# Altium schematic sheet dental-uint-doctors_table v1_0.SchDoc
size 840 x 594 mm
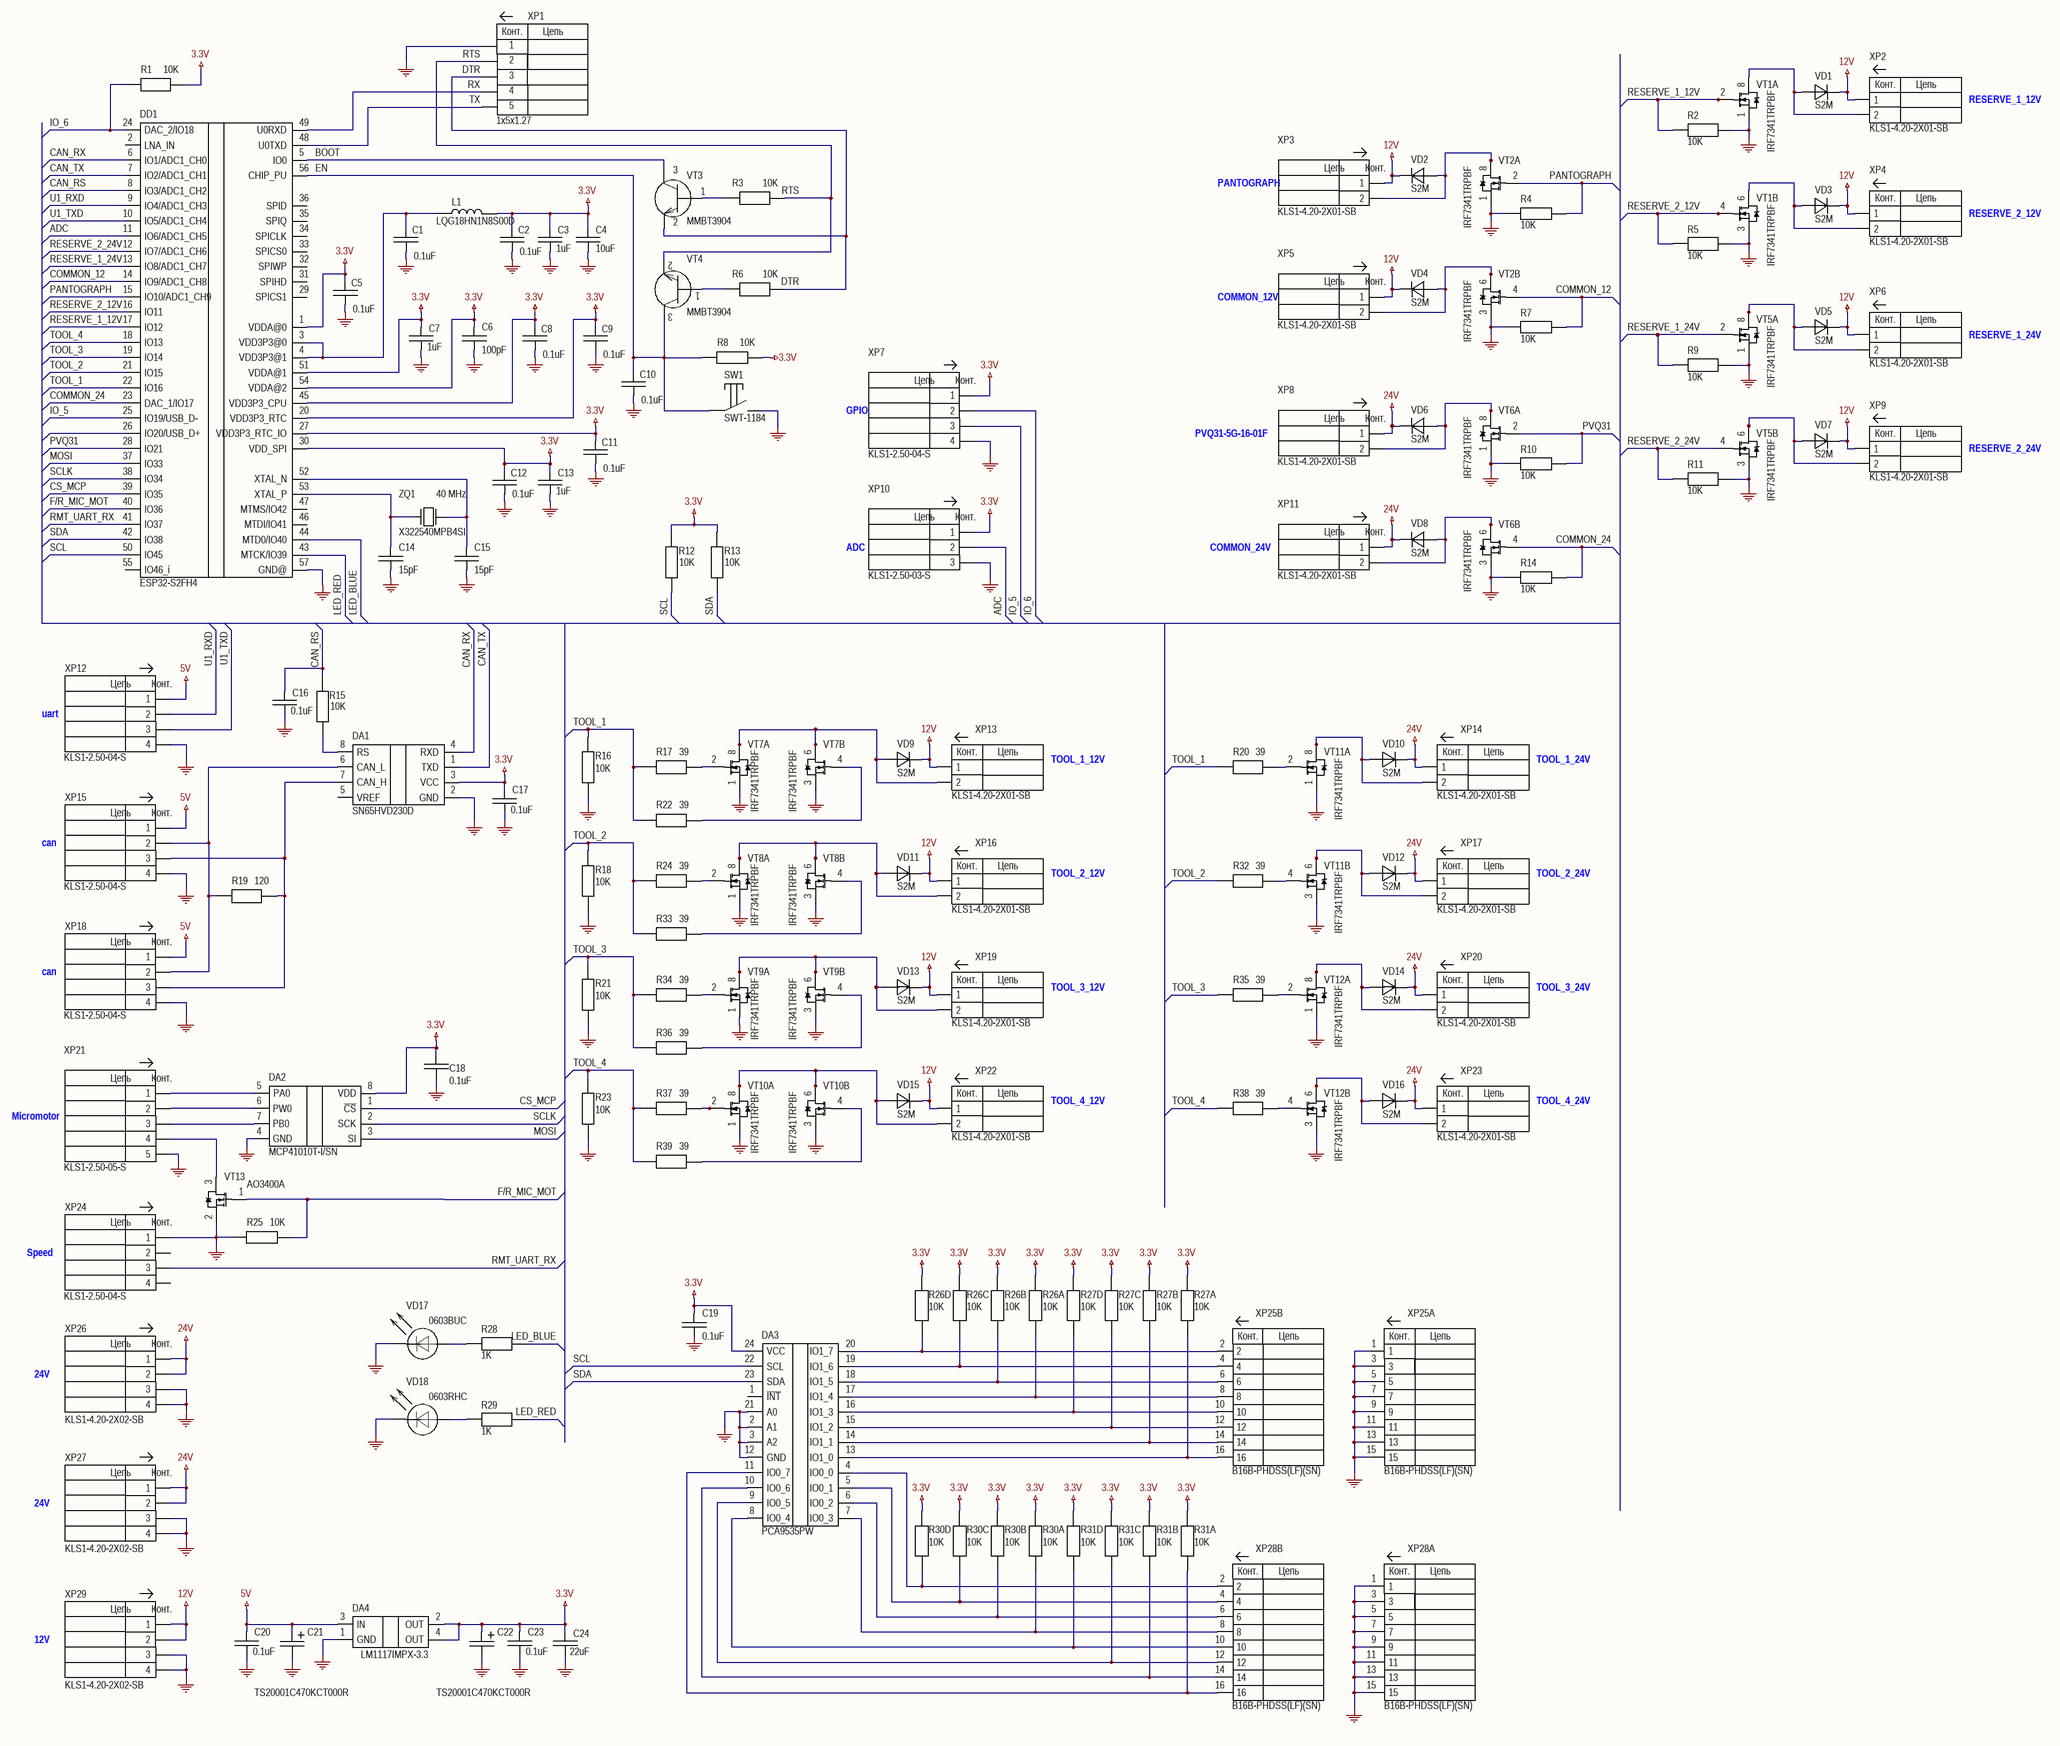
[diagram p0: dental-uint-doctors_table v1_0.SchDoc]

## Parts
C1  value 0.1uF  [CC_0603]  (hidden comment: CC0603KRX7R5BB104)
C2  value 0.1uF  [CC_0603]  (hidden comment: CC0603KRX7R5BB104)
C3  value 1uF  [CC_0603]  (hidden comment: CL10A105KB8NNNC)
C4  value 10uF  [CC_0603]  (hidden comment: CL10A106KP8NNNC)
C5  value 0.1uF  [CC_0603]  (hidden comment: CC0603KRX7R5BB104)
C6  value 100pF  [CC_0603]  (hidden comment: CC0603FRNPO9BN101)
C7  value 1uF  [CC_0603]  (hidden comment: CL10A105KB8NNNC)
C8  value 0.1uF  [CC_0603]  (hidden comment: CC0603KRX7R5BB104)
C9  value 0.1uF  [CC_0603]  (hidden comment: CC0603KRX7R5BB104)
C10  value 0.1uF  [CC_0603]  (hidden comment: CC0603KRX7R5BB104)
C11  value 0.1uF  [CC_0603]  (hidden comment: CC0603KRX7R5BB104)
C12  value 0.1uF  [CC_0603]  (hidden comment: CC0603KRX7R5BB104)
C13  value 1uF  [CC_0603]  (hidden comment: CL10A105KB8NNNC)
C14  value 15pF  [CC_0603]  (hidden comment: CC0603GPNPO9BN150)
C15  value 15pF  [CC_0603]  (hidden comment: CC0603GPNPO9BN150)
C16  value 0.1uF  [CC_0603]  (hidden comment: CC0603KRX7R5BB104)
C17  value 0.1uF  [CC_0603]  (hidden comment: CC0603KRX7R5BB104)
C18  value 0.1uF  [CC_0603]  (hidden comment: CC0603KRX7R5BB104)
C19  value 0.1uF  [CC_0603]  (hidden comment: CC0603KRX7R5BB104)
C20  value 0.1uF  [CC_0603]  (hidden comment: CC0603KRX7R5BB104)
C21  TS20001C470KCT000R  [CC_TANT_C]
C22  TS20001C470KCT000R  [CC_TANT_C]
C23  value 0.1uF  [CC_0603]  (hidden comment: CC0603KRX7R5BB104)
C24  value 22uF  [CC_0805]  (hidden comment: GRM21BR60J226ME39L)
DA1  SN65HVD230D  [SOIC-8]
DA2  MCP41010T-I/SN  [SOIC-8]
DA3  PCA9535PW  [TSSOP-24]
DA4  LM1117IMPX-3.3  [SOT-223]
DD1  ESP32-S2FH4  [QFN40P700X700X90-57T400N]
L1  LQG18HN1N8S00D  [IC_0603]
R1  value 10K  [RC_0603]  (hidden comment: AC0603FR-0710KL)
R2  value 10K  [RC_0603]  (hidden comment: AC0603FR-0710KL)
R3  value 10K  [RC_0603]  (hidden comment: AC0603FR-0710KL)
R4  value 10K  [RC_0603]  (hidden comment: AC0603FR-0710KL)
R5  value 10K  [RC_0603]  (hidden comment: AC0603FR-0710KL)
R6  value 10K  [RC_0603]  (hidden comment: AC0603FR-0710KL)
R7  value 10K  [RC_0603]  (hidden comment: AC0603FR-0710KL)
R8  value 10K  [RC_0603]  (hidden comment: AC0603FR-0710KL)
R9  value 10K  [RC_0603]  (hidden comment: AC0603FR-0710KL)
R10  value 10K  [RC_0603]  (hidden comment: AC0603FR-0710KL)
R11  value 10K  [RC_0603]  (hidden comment: AC0603FR-0710KL)
R12  value 10K  [RC_0603]  (hidden comment: AC0603FR-0710KL)
R13  value 10K  [RC_0603]  (hidden comment: AC0603FR-0710KL)
R14  value 10K  [RC_0603]  (hidden comment: AC0603FR-0710KL)
R15  value 10K  [RC_0603]  (hidden comment: AC0603FR-0710KL)
R16  value 10K  [RC_0603]  (hidden comment: AC0603FR-0710KL)
R17  value 39  [RC_0603]  (hidden comment: RC0603FR-0739RL)
R18  value 10K  [RC_0603]  (hidden comment: AC0603FR-0710KL)
R19  value 120  [RC_0603]  (hidden comment: RC0603FR-07120RL)
R20  value 39  [RC_0603]  (hidden comment: RC0603FR-0739RL)
R21  value 10K  [RC_0603]  (hidden comment: AC0603FR-0710KL)
R22  value 39  [RC_0603]  (hidden comment: RC0603FR-0739RL)
R23  value 10K  [RC_0603]  (hidden comment: AC0603FR-0710KL)
R24  value 39  [RC_0603]  (hidden comment: RC0603FR-0739RL)
R25  value 10K  [RC_0603]  (hidden comment: AC0603FR-0710KL)
R26  value 10K  [RC_0603x4]  (hidden comment: YC164-JR-0710KL)  (parts A,B,C,D of 4)
R27  value 10K  [RC_0603x4]  (hidden comment: YC164-JR-0710KL)  (parts A,B,C,D of 4)
R28  value 1K  [RC_0603]  (hidden comment: AC0603FR-071KL)
R29  value 1K  [RC_0603]  (hidden comment: AC0603FR-071KL)
R30  value 10K  [RC_0603x4]  (hidden comment: YC164-JR-0710KL)  (parts A,B,C,D of 4)
R31  value 10K  [RC_0603x4]  (hidden comment: YC164-JR-0710KL)  (parts A,B,C,D of 4)
R32  value 39  [RC_0603]  (hidden comment: RC0603FR-0739RL)
R33  value 39  [RC_0603]  (hidden comment: RC0603FR-0739RL)
R34  value 39  [RC_0603]  (hidden comment: RC0603FR-0739RL)
R35  value 39  [RC_0603]  (hidden comment: RC0603FR-0739RL)
R36  value 39  [RC_0603]  (hidden comment: RC0603FR-0739RL)
R37  value 39  [RC_0603]  (hidden comment: RC0603FR-0739RL)
R38  value 39  [RC_0603]  (hidden comment: RC0603FR-0739RL)
R39  value 39  [RC_0603]  (hidden comment: RC0603FR-0739RL)
SW1  SWT-1184  [IT-1184]
VD1  S2M  [DO-214AA(SMB)]
VD2  S2M  [DO-214AA(SMB)]
VD3  S2M  [DO-214AA(SMB)]
VD4  S2M  [DO-214AA(SMB)]
VD5  S2M  [DO-214AA(SMB)]
VD6  S2M  [DO-214AA(SMB)]
VD7  S2M  [DO-214AA(SMB)]
VD8  S2M  [DO-214AA(SMB)]
VD9  S2M  [DO-214AA(SMB)]
VD10  S2M  [DO-214AA(SMB)]
VD11  S2M  [DO-214AA(SMB)]
VD12  S2M  [DO-214AA(SMB)]
VD13  S2M  [DO-214AA(SMB)]
VD14  S2M  [DO-214AA(SMB)]
VD15  S2M  [DO-214AA(SMB)]
VD16  S2M  [DO-214AA(SMB)]
VD17  0603BUC  [LED_0603]
VD18  0603RHC  [LED_0603]
VT1  IRF7341TRPBF  [SOIC-8]  (parts A,B of 2)
VT2  IRF7341TRPBF  [SOIC-8]  (parts A,B of 2)
VT3  MMBT3904  [SOT-23-3]
VT4  MMBT3904  [SOT-23-3]
VT5  IRF7341TRPBF  [SOIC-8]  (parts A,B of 2)
VT6  IRF7341TRPBF  [SOIC-8]  (parts A,B of 2)
VT7  IRF7341TRPBF  [SOIC-8]  (parts A,B of 2)
VT8  IRF7341TRPBF  [SOIC-8]  (parts A,B of 2)
VT9  IRF7341TRPBF  [SOIC-8]  (parts A,B of 2)
VT10  IRF7341TRPBF  [SOIC-8]  (parts A,B of 2)
VT11  IRF7341TRPBF  [SOIC-8]  (parts A,B of 2)
VT12  IRF7341TRPBF  [SOIC-8]  (parts A,B of 2)
VT13  AO3400A  [SOT-23-3]
XP1  1x5x1.27  [XT_1x5x1.27_offset]
XP2  KLS1-4.20-2X01-SB  name: RESERVE_1_12V  [KLS1-4.20-2X01-SB]
XP3  KLS1-4.20-2X01-SB  name: PANTOGRAPH  [KLS1-4.20-2X01-SB]
XP4  KLS1-4.20-2X01-SB  name: RESERVE_2_12V  [KLS1-4.20-2X01-SB]
XP5  KLS1-4.20-2X01-SB  name: COMMON_12V  [KLS1-4.20-2X01-SB]
XP6  KLS1-4.20-2X01-SB  name: RESERVE_1_24V  [KLS1-4.20-2X01-SB]
XP7  KLS1-2.50-04-S  name: GPIO  [KLS1-2.50-04-S]
XP8  KLS1-4.20-2X01-SB  name: PVQ31-5G-16-01F  [KLS1-4.20-2X01-SB]
XP9  KLS1-4.20-2X01-SB  name: RESERVE_2_24V  [KLS1-4.20-2X01-SB]
XP10  KLS1-2.50-03-S  name: ADC  [KLS1-2.50-03-S]
XP11  KLS1-4.20-2X01-SB  name: COMMON_24V  [KLS1-4.20-2X01-SB]
XP12  KLS1-2.50-04-S  name: uart  [KLS1-2.50-04-S]
XP13  KLS1-4.20-2X01-SB  name: TOOL_1_12V  [KLS1-4.20-2X01-SB]
XP14  KLS1-4.20-2X01-SB  name: TOOL_1_24V  [KLS1-4.20-2X01-SB]
XP15  KLS1-2.50-04-S  name: can  [KLS1-2.50-04-S]
XP16  KLS1-4.20-2X01-SB  name: TOOL_2_12V  [KLS1-4.20-2X01-SB]
XP17  KLS1-4.20-2X01-SB  name: TOOL_2_24V  [KLS1-4.20-2X01-SB]
XP18  KLS1-2.50-04-S  name: can  [KLS1-2.50-04-S]
XP19  KLS1-4.20-2X01-SB  name: TOOL_3_12V  [KLS1-4.20-2X01-SB]
XP20  KLS1-4.20-2X01-SB  name: TOOL_3_24V  [KLS1-4.20-2X01-SB]
XP21  KLS1-2.50-05-S  name: Micromotor  [KLS1-2.50-05-S]
XP22  KLS1-4.20-2X01-SB  name: TOOL_4_12V  [KLS1-4.20-2X01-SB]
XP23  KLS1-4.20-2X01-SB  name: TOOL_4_24V  [KLS1-4.20-2X01-SB]
XP24  KLS1-2.50-04-S  name: Speed  [KLS1-2.50-04-S]
XP25  B16B-PHDSS(LF)(SN)  [B16B-PHDSS]  (parts A,B of 2)
XP26  KLS1-4.20-2X02-SB  name: 24V  [KLS1-4.20-2X02-SB]
XP27  KLS1-4.20-2X02-SB  name: 24V  [KLS1-4.20-2X02-SB]
XP28  B16B-PHDSS(LF)(SN)  [B16B-PHDSS]  (parts A,B of 2)
XP29  KLS1-4.20-2X02-SB  name: 12V  [KLS1-4.20-2X02-SB]
ZQ1  X322540MPB4SI  value 40 MHz  [OSC: 3225]

## Nets
3.3V: C2.2 C3.2 C4.2 C5.2 C6.2 C7.2 C8.2 C9.2 C11.2 C12.2 C13.2 C17.2 C18.2 C19.2 C22.1 C23.2 C24.2 DA1.3(VCC) DA2.8(VDD) DA3.24(VCC) DA4.2(OUT) DA4.4(OUT) DD1.1(VDDA@0) DD1.20(VDD3P3_RTC) DD1.27(VDD3P3_RTC_IO) DD1.30(VDD_SPI) DD1.45(VDD3P3_CPU) DD1.51(VDDA@1) DD1.54(VDDA@2) L1.2 R1.2 R8.2 R12.2 R13.2 R26.5 R26.6 R26.7 R26.8 R27.5 R27.6 R27.7 R27.8 R30.5 R30.6 R30.7 R30.8 R31.5 R31.6 R31.7 R31.8 XP7.1 XP10.1
5V: C20.2 C21.1 DA4.3(IN) XP12.1 XP15.1 XP18.1
12V: VD1.2(C) VD2.2(C) VD3.2(C) VD4.2(C) VD5.2(C) VD7.2(C) VD9.2(C) VD11.2(C) VD13.2(C) VD15.2(C) XP2.1 XP3.1 XP4.1 XP5.1 XP6.1 XP9.1 XP13.1 XP16.1 XP19.1 XP22.1 XP29.1 XP29.2
24V: VD6.2(C) VD8.2(C) VD10.2(C) VD12.2(C) VD14.2(C) VD16.2(C) XP8.1 XP11.1 XP14.1 XP17.1 XP20.1 XP23.1 XP26.1 XP26.2 XP27.1 XP27.2
GND: C1.1 C2.1 C3.1 C4.1 C5.1 C6.1 C7.1 C8.1 C9.1 C10.1 C11.1 C12.1 C13.1 C14.1 C15.1 C16.1 C17.1 C18.1 C19.1 C20.1 C21.2 C22.2 C23.1 C24.1 DA1.2(GND) DA2.4(GND) DA3.2(A1) DA3.3(A2) DA3.12(GND) DA3.21(A0) DA4.1(GND) DD1.57(GND@) R2.2 R4.2 R5.2 R7.2 R9.2 R10.2 R11.2 R14.2 R16.1 R18.1 R21.1 R23.1 R25.1 SW1.2 VD17.2(C) VD18.2(C) VT1.1(S1) VT1.3(S2) VT2.1(S1) VT2.3(S2) VT5.1(S1) VT5.3(S2) VT6.1(S1) VT6.3(S2) VT7.1(S1) VT7.3(S2) VT8.1(S1) VT8.3(S2) VT9.1(S1) VT9.3(S2) VT10.1(S1) VT10.3(S2) VT11.1(S1) VT11.3(S2) VT12.1(S1) VT12.3(S2) VT13.2(D) XP1.1 XP7.4 XP10.3 XP12.4 XP15.4 XP18.4 XP21.5 XP24.1 XP25.1 XP25.3 XP25.5 XP25.7 XP25.9 XP25.11 XP25.13 XP25.15 XP26.3 XP26.4 XP27.3 XP27.4 XP28.1 XP28.3 XP28.5 XP28.7 XP28.9 XP28.11 XP28.13 XP28.15 XP29.3 XP29.4
ADC: DD1.11(IO6/ADC1_CH5) XP10.2
BOOT: DD1.5(IO0) VT3.3(C)
CAN_RS: C16.2 DD1.8(IO3/ADC1_CH2) R15.2
CAN_RX: DA1.4(RXD) DD1.6(IO1/ADC1_CH0)
CAN_TX: DA1.1(TXD) DD1.7(IO2/ADC1_CH1)
COMMON_12: DD1.14(IO9/ADC1_CH8) R7.1 VT2.4(G2)
COMMON_24: DD1.23(DAC_1/IO17) R14.1 VT6.4(G2)
CS_MCP: DA2.1(~{CS}) DD1.39(IO35)
DTR: R6.2 VT3.2(E) XP1.3
EN: C10.2 DD1.56(CHIP_PU) R8.1 SW1.1 VT4.3(C)
F/R_MIC_MOT: DD1.40(IO36) R25.2 VT13.1(G)
IO_5: DD1.25(IO19/USB_D-) XP7.3
IO_6: DD1.24(DAC_2/IO18) R1.1 XP7.2
LED_BLUE: DD1.44(MTD0/IO40) R28.1
LED_RED: DD1.43(MTCK/IO39) R29.1
MOSI: DA2.3(SI) DD1.37(IO33)
PANTOGRAPH: DD1.15(IO10/ADC1_CH9) R4.1 VT2.2(G1)
PVQ31: DD1.28(IO21) R10.1 VT6.2(G1)
RESERVE_1_12V: DD1.17(IO12) R2.1 VT1.2(G1)
RESERVE_1_24V: DD1.13(IO8/ADC1_CH7) R9.1 VT5.2(G1)
RESERVE_2_12V: DD1.16(IO11) R5.1 VT1.4(G2)
RESERVE_2_24V: DD1.12(IO7/ADC1_CH6) R11.1 VT5.4(G2)
RMT_UART_RX: DD1.41(IO37) XP24.3
RTS: R3.2 VT4.2(E) XP1.2
RX: DD1.49(U0RXD) XP1.4
SCL: DA3.22(SCL) DD1.50(IO45) R12.1
SCLK: DA2.2(SCK) DD1.38(IO34)
SDA: DA3.23(SDA) DD1.42(IO38) R13.1
TOOL_1: DD1.22(IO16) R16.2 R17.2 R20.2 R22.2
TOOL_2: DD1.21(IO15) R18.2 R24.2 R32.2 R33.2
TOOL_3: DD1.19(IO14) R21.2 R34.2 R35.2 R36.2
TOOL_4: DD1.18(IO13) R23.2 R37.2 R38.2 R39.2
TX: DD1.48(U0TXD) XP1.5
U1_RXD: DD1.9(IO4/ADC1_CH3) XP12.2
U1_TXD: DD1.10(IO5/ADC1_CH4) XP12.3
NetC1_2: C1.2 DD1.3(VDD3P3@0) DD1.4(VDD3P3@1) L1.1
NetC14_2: C14.2 DD1.53(XTAL_P) ZQ1.1
NetC15_2: C15.2 DD1.52(XTAL_N) ZQ1.3
NetDA1_6: DA1.6(CAN_L) R19.2 XP15.2 XP18.2
NetDA1_7: DA1.7(CAN_H) R19.1 XP15.3 XP18.3
NetDA1_8: DA1.8(RS) R15.1
NetDA2_5: DA2.5(PA0) XP21.1
NetDA2_6: DA2.6(PW0) XP21.2
NetDA2_7: DA2.7(PB0) XP21.3
NetDA3_4: DA3.4(IO0_0) R30.4 XP28.2
NetDA3_5: DA3.5(IO0_1) R30.3 XP28.4
NetDA3_6: DA3.6(IO0_2) R30.2 XP28.6
NetDA3_7: DA3.7(IO0_3) R30.1 XP28.8
NetDA3_8: DA3.8(IO0_4) R31.4 XP28.10
NetDA3_9: DA3.9(IO0_5) R31.3 XP28.12
NetDA3_10: DA3.10(IO0_6) R31.2 XP28.14
NetDA3_11: DA3.11(IO0_7) R31.1 XP28.16
NetDA3_13: DA3.13(IO1_0) R27.1 XP25.16
NetDA3_14: DA3.14(IO1_1) R27.2 XP25.14
NetDA3_15: DA3.15(IO1_2) R27.3 XP25.12
NetDA3_16: DA3.16(IO1_3) R27.4 XP25.10
NetDA3_17: DA3.17(IO1_4) R26.1 XP25.8
NetDA3_18: DA3.18(IO1_5) R26.2 XP25.6
NetDA3_19: DA3.19(IO1_6) R26.3 XP25.4
NetDA3_20: DA3.20(IO1_7) R26.4 XP25.2
NetR3_1: R3.1 VT3.1(B)
NetR6_1: R6.1 VT4.1(B)
NetR17_1: R17.1 VT7.2(G1)
NetR20_1: R20.1 VT11.2(G1)
NetR22_1: R22.1 VT7.4(G2)
NetR24_1: R24.1 VT8.2(G1)
NetR28_2: R28.2 VD17.1(A)
NetR29_2: R29.2 VD18.1(A)
NetR32_1: R32.1 VT11.4(G2)
NetR33_1: R33.1 VT8.4(G2)
NetR34_1: R34.1 VT9.2(G1)
NetR35_1: R35.1 VT12.2(G1)
NetR36_1: R36.1 VT9.4(G2)
NetR37_1: R37.1 VT10.2(G1)
NetR38_1: R38.1 VT12.4(G2)
NetR39_1: R39.1 VT10.4(G2)
NetVD1_1: VD1.1(A) VT1.7(D1) VT1.8(D1) XP2.2
NetVD2_1: VD2.1(A) VT2.7(D1) VT2.8(D1) XP3.2
NetVD3_1: VD3.1(A) VT1.5(D1) VT1.6(D1) XP4.2
NetVD4_1: VD4.1(A) VT2.5(D1) VT2.6(D1) XP5.2
NetVD5_1: VD5.1(A) VT5.7(D1) VT5.8(D1) XP6.2
NetVD6_1: VD6.1(A) VT6.7(D1) VT6.8(D1) XP8.2
NetVD7_1: VD7.1(A) VT5.5(D1) VT5.6(D1) XP9.2
NetVD8_1: VD8.1(A) VT6.5(D1) VT6.6(D1) XP11.2
NetVD9_1: VD9.1(A) VT7.5(D1) VT7.6(D1) VT7.7(D1) VT7.8(D1) XP13.2
NetVD10_1: VD10.1(A) VT11.7(D1) VT11.8(D1) XP14.2
NetVD11_1: VD11.1(A) VT8.5(D1) VT8.6(D1) VT8.7(D1) VT8.8(D1) XP16.2
NetVD12_1: VD12.1(A) VT11.5(D1) VT11.6(D1) XP17.2
NetVD13_1: VD13.1(A) VT9.5(D1) VT9.6(D1) VT9.7(D1) VT9.8(D1) XP19.2
NetVD14_1: VD14.1(A) VT12.7(D1) VT12.8(D1) XP20.2
NetVD15_1: VD15.1(A) VT10.5(D1) VT10.6(D1) VT10.7(D1) VT10.8(D1) XP22.2
NetVD16_1: VD16.1(A) VT12.5(D1) VT12.6(D1) XP23.2
NetVT13_3: VT13.3(S) XP21.4

Not connected (* = marked no-connect by the designer): DA1 5(VREF); DA3 1(~{INT}); DD1 2(LNA_IN) 26(IO20/USB_D+) 29(SPICS1) 31(SPIHD) 32(SPIWP) 33(SPICS0) 34(SPICLK) 35(SPIQ) 36(SPID) 46(MTDI/IO41) 47(MTMS/IO42) 55(IO46_i); XP24 2 4; ZQ1 2 4

## Notes on the sheet
- Перв. примен.
- Справ. №
- Подп. и дата
- Инв. № дубл.
- Взам. инв. №
- Разраб.
- Изм.
- Лист
- № докум.
- Подп.
- Дата
- Лит.
- Масса
- Масштаб
- Пров.
- Т.контр.
- Листов
- Инв. № подл.
- Утв.
- Н.контр.
- 2.106-A1
- Копировал
- Формат А1
- (in symbol B16B-PHDSS(LF)(SN), part A) Конт.; Цепь
- (in symbol B16B-PHDSS(LF)(SN), part B) Конт.; Цепь
- (in symbol KLS1-2.50-03-x) Цепь; Конт.
- (in symbol KLS1-2.50-04-x) Цепь; Конт.
- (in symbol KLS1-2.50-05-x) Цепь; Конт.
- (in symbol KLS1-4.20-2X01-x) Конт.; Цепь
- (in symbol KLS1-4.20-2X02-x) Цепь; Конт.
- (in symbol XT_1x5x1_27) Конт.; Цепь

## Library data of the parts
C1 C2 C5 C8-C12 C16-C20 C23 = C: Cap Ceramic, 0603, 0.1u, 10%, 16V, X7R (Yageo); type: CC0603KRX7R5BB104
C3 C7 C13 = C: Cap Ceramic, 0603, 1u, 10%, 50V, X5R (Sumsung); type: CL10A105KB8NNNC
C4 = C: Cap Ceramic, 0603, 10u, 10%, 16V, X5R (Sumsung); type: CL10A106KP8NNNC
C6 = C: Cap Ceramic, 0603, 100p, 1%, 50V, NP0 (Yageo); type: CC0603FRNPO9BN101
C14 C15 = C: Cap Ceramic, 0603, 15pF, 50V, NP0 (Yageo); type: CC0603GPNPO9BN150
C21 C22 = C_polar: 47uF, 16v, C, 10%, @SUNTAN,; value: 47uF; type: TS20001C470KCT000R
C24 = C: Cap Ceramic, 0805, 22u, 20%, 6.3V, X5R, -55 +85C (Murata); type: GRM21BR60J226ME39L
DA1 = SN65HVD230D: 3.3-V CAN TRANSCEIVERS, @TI; type: SN65HVD230D; ComponentLink1Description: link; ComponentLink1URL: https://www.elitan.ru/pdf/0/1/8/5/1/01851789.pdf
DA2 = MCP41010T-I/SN: Single/Dual Digital Potentiometer, 10k, @MICROCHIP; type: MCP41010T-I/SN; ComponentLink1Description: link; ComponentLink1URL: https://www.elitan.ru/pdf/0/1/8/0/9/01809191.pdf
DA3 = PCA9535PW: I2C I/O EXPANDER; type: PCA9554ARGTR
DA4 = LM1117IMPX-3.3: LDO, 3.3v, 0.8A, SOT-223, Texas Instruments; type: LM1117S-3.3
DD1 = ESP32-S2: SMD WI-FI IC, ESP32-S2FH4, SINGAL-C; MF: Espressif Systems; Value: ESP32-S2; Package: None; Price: None; MP: ESP32-S2; Availability: Unavailable; SnapEDA_Link: https://www.snapeda.com/parts/ESP32-S2/Espressif%20Systems/view-part/4571535/?ref=snap; ComponentLink1Description: link; ComponentLink1URL: https://www.espressif.com/sites/default/files/documentation/esp32-s2_datasheet_en.pdf
L1 = L: 1.1A, 1.8nH,100mΩ, 0603, Inductors (SMD), @MURATA; type: 0603; value: LQG18HN1N8S00D
R1-R16 R18 R21 R23 R25 = R: Res, 0603, 10K, 1%, 0.25W (ф. Yageo); type: AC0603FR-0710KL; power: 0.25W
R17 R20 R22 R24 R32-R39 = R: Res, 0603, 39, 1%, 0.25W (ф. Yageo); type: RC0603FR-0739RL; power: 0.25W
R19 = R: Res, 0603, 120, 1%, 0.25W (ф. Yageo); type: RC0603FR-07120RL; power: 0.25W
R26 R27 R30 R31 = R_Array: Res, 0603x4, 10K, 5%, 0.25W (ф. Yageo); type: YC164-JR-0710KL; power: 0.25W
R28 R29 = R: Res, 0603, 1K 1%, 0.25W (ф. Yageo); type: AC0603FR-071KL; power: 0.25W
SW1 = smd-side-push-button
VD1-VD16 = D: 1000В, 2А, 2,5мкс, SMB, @DIODES; type: S2M
VD17 = LED: Led, 0603, BLUE, 20mA, 125, 140MCD, CPMELEC
VD18 = LED: Led, 0603, RED, 20mA, 125, 140MCD, CPMELEC
VT1 VT2 VT5-VT12 = IRF7341TRPBF: Dual N-Channel  MOSFET; type: IRF7341TRPBF
VT3 VT4 = N-P-N-SOT-23: type: MMBT3904
VT13 = AO3400A: N-channel  Power MOSFET, Vds: 30v, Id: 5.7A; type: AO3400A
XP1 = XT_1x5x1_27: type: 1x5x1.27
XP2-XP6 XP8 XP9 XP11 XP13 XP14 XP16 XP17 XP19 XP20 XP22 XP23 = KLS1-4.20-2X01-x: 4.2mm, 2pin, KLS; ComponentLink1Description: link; ComponentLink1URL: https://www.elitan.ru/pdf/1/1/8/6/4/11864968.pdf
XP7 XP12 XP15 XP18 XP24 = KLS1-2.50-04-x: 2.5mm, 4pin, KLS; ComponentLink1Description: link; ComponentLink1URL: https://www.triatron.ru/upload/catalog_photo/elements/pdf/212764.pdf
XP10 = KLS1-2.50-03-x: 2.5mm, 3pin, KLS; ComponentLink1Description: link; ComponentLink1URL: https://www.triatron.ru/upload/catalog_photo/elements/pdf/212764.pdf
XP21 = KLS1-2.50-05-x: 2.5mm, 5pin, KLS; ComponentLink1Description: link; ComponentLink1URL: https://www.triatron.ru/upload/catalog_photo/elements/pdf/212764.pdf
XP26 XP27 XP29 = KLS1-4.20-2X02-x: 4.2mm, 4pin, KLS; ComponentLink1Description: link; ComponentLink1URL: https://www.elitan.ru/pdf/1/1/8/6/4/11864968.pdf
ZQ1 = OSC 3225: 40MHz, 15pF, ±10ppm, SMD3225-4P, Crystals ROHS, @YXC; type: X322540MPB4SI
XP25 XP28 = B16B-PHDSS(LF)(SN): type: B16B-PHDSS(LF)(SN)